# EAGLE schematic LEDDriver_v_4 (EAGLE 6.4)
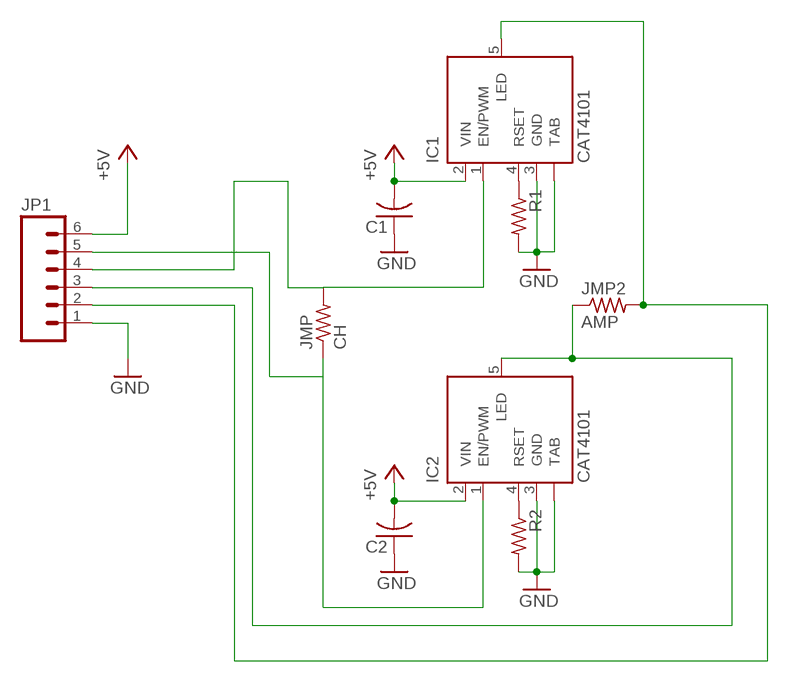
[diagram p0: schematic, sheet 1]

## Parts
C1  C-USC1206  [C1206]
C2  C-USC1206  [C1206]
IC1  CAT4101  [TO263_5]
IC2  CAT4101  [TO263_5]
JMP  CH  R-US_R1206  [R1206]
JMP2  AMP  R-US_R1206  [R1206]
JP1  M06POGOPIN_HOLES_ONLY  [1X06_HOLES_ONLY]
R1  R-US_R1206  [R1206]
R2  R-US_R1206  [R1206]

## Nets
+5V: C1.2 C2.2 IC1.2(VIN) IC2.2(VIN) JP1.6
GND: C1.1 C2.1 IC1.3(GND) IC1.TAB IC2.3(GND) IC2.TAB JP1.1 R1.2 R2.2
N$1: IC1.1(EN/PWM) JMP.2 JP1.4
N$2: IC2.1(EN/PWM) JMP.1 JP1.5
N$3: IC1.4(RSET) R1.1
N$4: IC2.5(LED) JMP2.1 JP1.3
N$5: IC1.5(LED) JMP2.2 JP1.2
N$8: IC2.4(RSET) R2.1

## Library data of the parts
C1 C2 = adafruit:C-US: CAPACITOR, American symbol
IC1 IC2 = on-semiconductor:CAT4101: 1A Constant-Current LED Driver with PWM Dimming Source: ON Semiconductor .. 4101.pdf; MPN: CAT4101TV-T75; OC_FARNELL: 1718452; OC_NEWARK: 08R5264
JMP JMP2 R1 R2 = adafruit:R-US_: RESISTOR, American symbol
JP1 = SparkFun-Connectors:M06: Header 6 Standard 6-pin 0.1" header. Use with straight break away headers (SKU : PRT-00116), right angle break away headers (PRT-00553), swiss pins (PRT-00743), machine pins (PRT-00117), and female headers (PRT-00115). Molex polarized connector foot print use with SKU : PRT-08094 with associated crimp pins and housings. NOTES ON THE VARIANTS LOCK and LOCK_LONGPADS... This footprint was designed to help hold the alignment of a through-hole component (i.e. 6-pin header) while soldering it into place. You may notice that each hole has been shifted either up or down by 0.005 of an inch from it's more standard position (which is a perfectly straight line). This slight alteration caused the pins (the squares in the middle) to touch the edges of the holes. Because they are alternating, it causes a "brace" to hold the component in place. 0.005 has proven to be the perfect amount of "off-center" position when using our standard breakaway headers. Although looks a little odd when you look at the bare footprint, once you have a header in there, the alteration is very hard to notice. Also,if you push a header all the way into place, it is covered up entirely on the bottom side. This idea of altering the position of holes to aid alignment will be further integrated into the Sparkfun Library for other footprints. It can help hold any component with 3 or more connection pins.